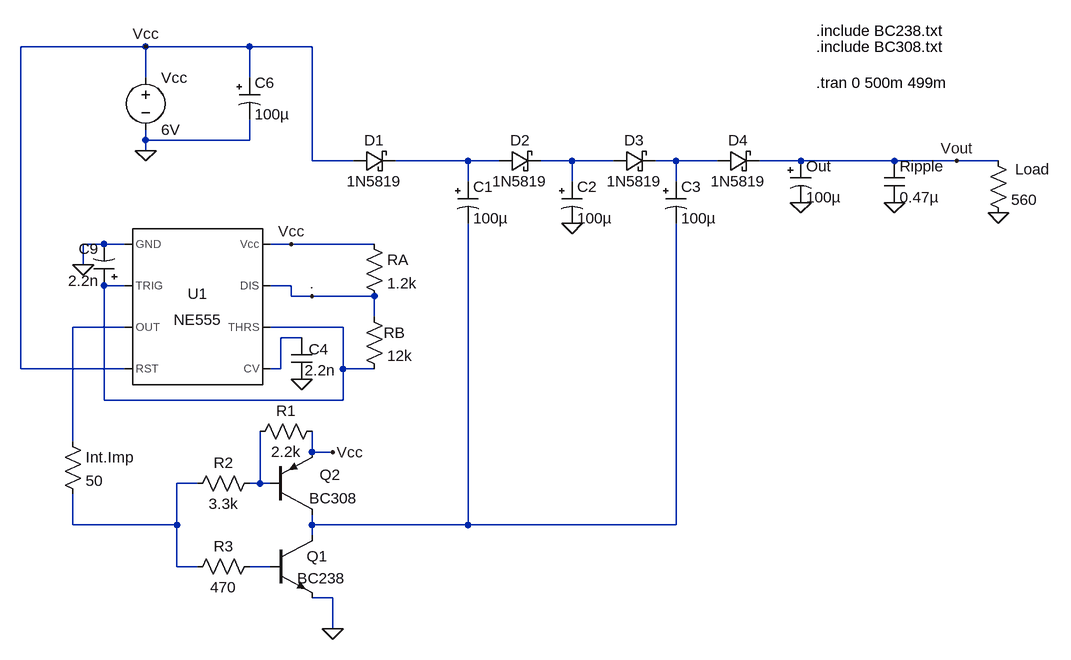
[diagram p0: schematic NE555_ChargePump_Simulation.asc]
NE555_ChargePump_Simulation.asc, the LTspice schematic file:
Version 4
SHEET 1 1700 1224
WIRE -64 80 -256 80
WIRE 96 80 -64 80
WIRE 192 80 96 80
WIRE -64 128 -64 80
WIRE 96 128 96 80
WIRE -64 224 -64 208
WIRE 96 224 96 192
WIRE 96 224 -64 224
WIRE -64 240 -64 224
WIRE 192 256 192 80
WIRE 256 256 192 256
WIRE 432 256 320 256
WIRE 480 256 432 256
WIRE 592 256 544 256
WIRE 656 256 592 256
WIRE 752 256 720 256
WIRE 816 256 752 256
WIRE 944 256 880 256
WIRE 1088 256 944 256
WIRE 1184 256 1088 256
WIRE 1248 256 1184 256
WIRE 432 288 432 256
WIRE 592 288 592 256
WIRE 752 288 752 256
WIRE -128 384 -160 384
WIRE -96 384 -128 384
WIRE 160 384 128 384
WIRE 288 384 160 384
WIRE -160 416 -160 384
WIRE -96 448 -128 448
WIRE 160 448 128 448
WIRE 160 464 160 448
WIRE 192 464 160 464
WIRE 288 464 192 464
WIRE 288 496 288 464
WIRE -96 512 -176 512
WIRE 240 512 128 512
WIRE 176 528 144 528
WIRE -256 576 -256 80
WIRE -96 576 -256 576
WIRE 144 576 144 528
WIRE 144 576 128 576
WIRE 240 576 240 512
WIRE 288 576 240 576
WIRE -128 624 -128 448
WIRE 240 624 240 576
WIRE 240 624 -128 624
WIRE -176 688 -176 512
WIRE 192 704 192 672
WIRE 224 704 192 704
WIRE 16 752 -16 752
WIRE 112 752 112 672
WIRE 112 752 96 752
WIRE 128 752 112 752
WIRE -176 816 -176 768
WIRE -16 816 -16 752
WIRE -16 816 -176 816
WIRE 192 816 192 800
WIRE 432 816 432 352
WIRE 432 816 192 816
WIRE 752 816 752 352
WIRE 752 816 432 816
WIRE 192 832 192 816
WIRE -16 880 -16 816
WIRE 16 880 -16 880
WIRE 128 880 96 880
WIRE 224 928 192 928
WIRE 224 976 224 928
FLAG -160 416 0
FLAG 1248 336 0
FLAG -64 240 0
FLAG 592 352 0
FLAG 944 320 0
FLAG 1184 256 Vout
FLAG 224 704 Vcc
FLAG -64 80 Vcc
FLAG 224 976 0
FLAG 1088 320 0
FLAG 192 464 .
FLAG 160 384 Vcc
FLAG 176 592 0
SYMBOL schottky 256 272 R270
WINDOW 0 32 32 VTop 2
WINDOW 3 0 32 VBottom 2
SYMATTR InstName D1
SYMATTR Value 1N5819
SYMATTR Description Diode
SYMATTR Type diode
SYMBOL Misc/NE555 16 480 R0
SYMATTR InstName U1
SYMBOL schottky 480 272 R270
WINDOW 0 32 32 VTop 2
WINDOW 3 0 32 VBottom 2
SYMATTR InstName D2
SYMATTR Value 1N5819
SYMATTR Description Diode
SYMATTR Type diode
SYMBOL schottky 656 272 R270
WINDOW 0 32 32 VTop 2
WINDOW 3 0 32 VBottom 2
SYMATTR InstName D3
SYMATTR Value 1N5819
SYMATTR Description Diode
SYMATTR Type diode
SYMBOL Res 1232 240 R0
WINDOW 0 42 29 Left 2
SYMATTR InstName Load
SYMATTR Value 560
SYMBOL Voltage -64 112 R0
SYMATTR InstName Vcc
SYMATTR Value 6V
SYMBOL Res 272 368 R0
SYMATTR InstName RA
SYMATTR Value 1.2k
SYMBOL Res 272 480 R0
WINDOW 0 63 40 Right 2
SYMATTR InstName RB
SYMATTR Value 12k
SYMBOL polcap 416 288 R0
SYMATTR InstName C1
SYMATTR Value 100µ
SYMATTR SpiceLine Rser=1
SYMBOL polcap 576 288 R0
SYMATTR InstName C2
SYMATTR Value 100µ
SYMATTR SpiceLine Rser=1
SYMBOL polcap 736 288 R0
SYMATTR InstName C3
SYMATTR Value 100µ
SYMATTR SpiceLine Rser=1
SYMBOL polcap -112 448 R180
WINDOW 0 24 57 Left 2
WINDOW 3 24 8 Left 2
SYMATTR InstName C9
SYMATTR Value 2.2n
SYMBOL polcap 928 256 R0
SYMATTR InstName Out
SYMATTR Value 100µ
SYMATTR SpiceLine Rser=1
SYMBOL schottky 816 272 R270
WINDOW 0 32 32 VTop 2
WINDOW 3 0 32 VBottom 2
SYMATTR InstName D4
SYMATTR Value 1N5819
SYMATTR Description Diode
SYMATTR Type diode
SYMBOL polcap 80 128 R0
SYMATTR InstName C6
SYMATTR Value 100µ
SYMATTR SpiceLine Rser=1
SYMBOL Cap 1072 256 R0
SYMATTR InstName Ripple
SYMATTR Value 0.47µ
SYMBOL npn 128 832 R0
WINDOW 3 41 66 Left 2
SYMATTR Value BC238
SYMATTR InstName Q1
SYMBOL pnp 128 800 M180
WINDOW 0 76 61 Left 2
WINDOW 3 60 25 Left 2
SYMATTR InstName Q2
SYMATTR Value BC308
SYMBOL Res 112 736 R90
WINDOW 0 0 56 VBottom 2
WINDOW 3 32 56 VTop 2
SYMATTR InstName R2
SYMATTR Value 3.3k
SYMBOL Res 112 864 R90
WINDOW 0 0 56 VBottom 2
WINDOW 3 32 56 VTop 2
SYMATTR InstName R3
SYMATTR Value 470
SYMBOL Res -192 672 R0
SYMATTR InstName Int.Imp
SYMATTR Value 50
SYMBOL res 208 656 R90
WINDOW 0 0 56 VBottom 2
WINDOW 3 32 56 VTop 2
SYMATTR InstName R1
SYMATTR Value 2.2k
SYMBOL Cap 160 528 R0
WINDOW 0 27 18 Left 2
WINDOW 3 21 50 Left 2
SYMATTR InstName C4
SYMATTR Value 2.2n
TEXT 968 136 Left 2 !.tran 0 500m 499m
TEXT 968 80 Left 2 !.include BC308.txt
TEXT 968 56 Left 2 !.include BC238.txt

The netlist it stands for:
* NE555_ChargePump_Simulation.asc
D1 Vcc N001 1N5819
XU1 0 N004 N005 Vcc N006 N004 . Vcc NE555  ; pins GND TRIG OUT RST CV THRS DIS Vcc
D2 N001 N002 1N5819
D3 N002 N003 1N5819
R§Load Vout 0 560
Vcc Vcc 0 6V
RA Vcc . 1.2k
RB . N004 12k
C1 N001 N009 100µ Rser=1
C2 N002 0 100µ Rser=1
C3 N003 N009 100µ Rser=1
C9 N004 0 2.2n
C§Out Vout 0 100µ Rser=1
D4 N003 Vout 1N5819
C6 Vcc 0 100µ Rser=1
C§Ripple Vout 0 0.47µ
Q1 N009 N010 0 0 BC238
Q2 N009 N008 Vcc 0 BC308
R2 N008 N007 3.3k
R3 N010 N007 470
R§Int.Imp N005 N007 50
R1 Vcc N008 2.2k
C4 N006 0 2.2n
.model D D
.lib standard.dio
.model NPN NPN
.model PNP PNP
.lib standard.bjt
.tran 0 500m 499m
.include BC308.txt
.include BC238.txt
.lib NE555.sub
.backanno
.end